# EAGLE schematic Car-layout (EAGLE 6.6.0)
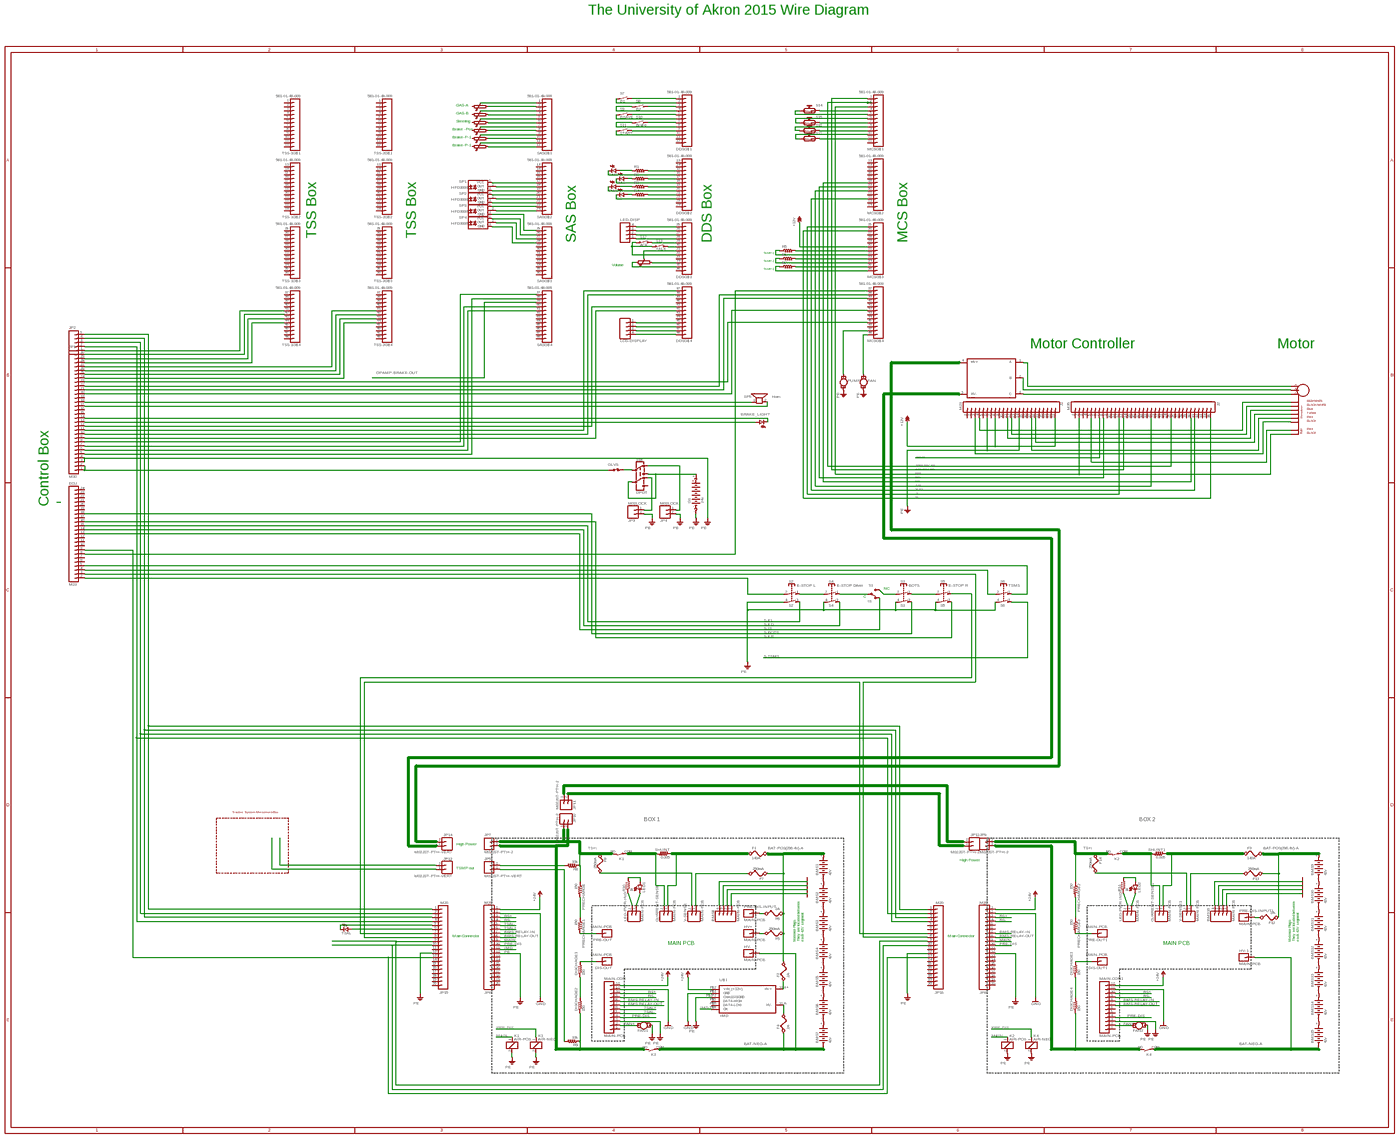
[diagram p0: schematic, sheet 1, overview]
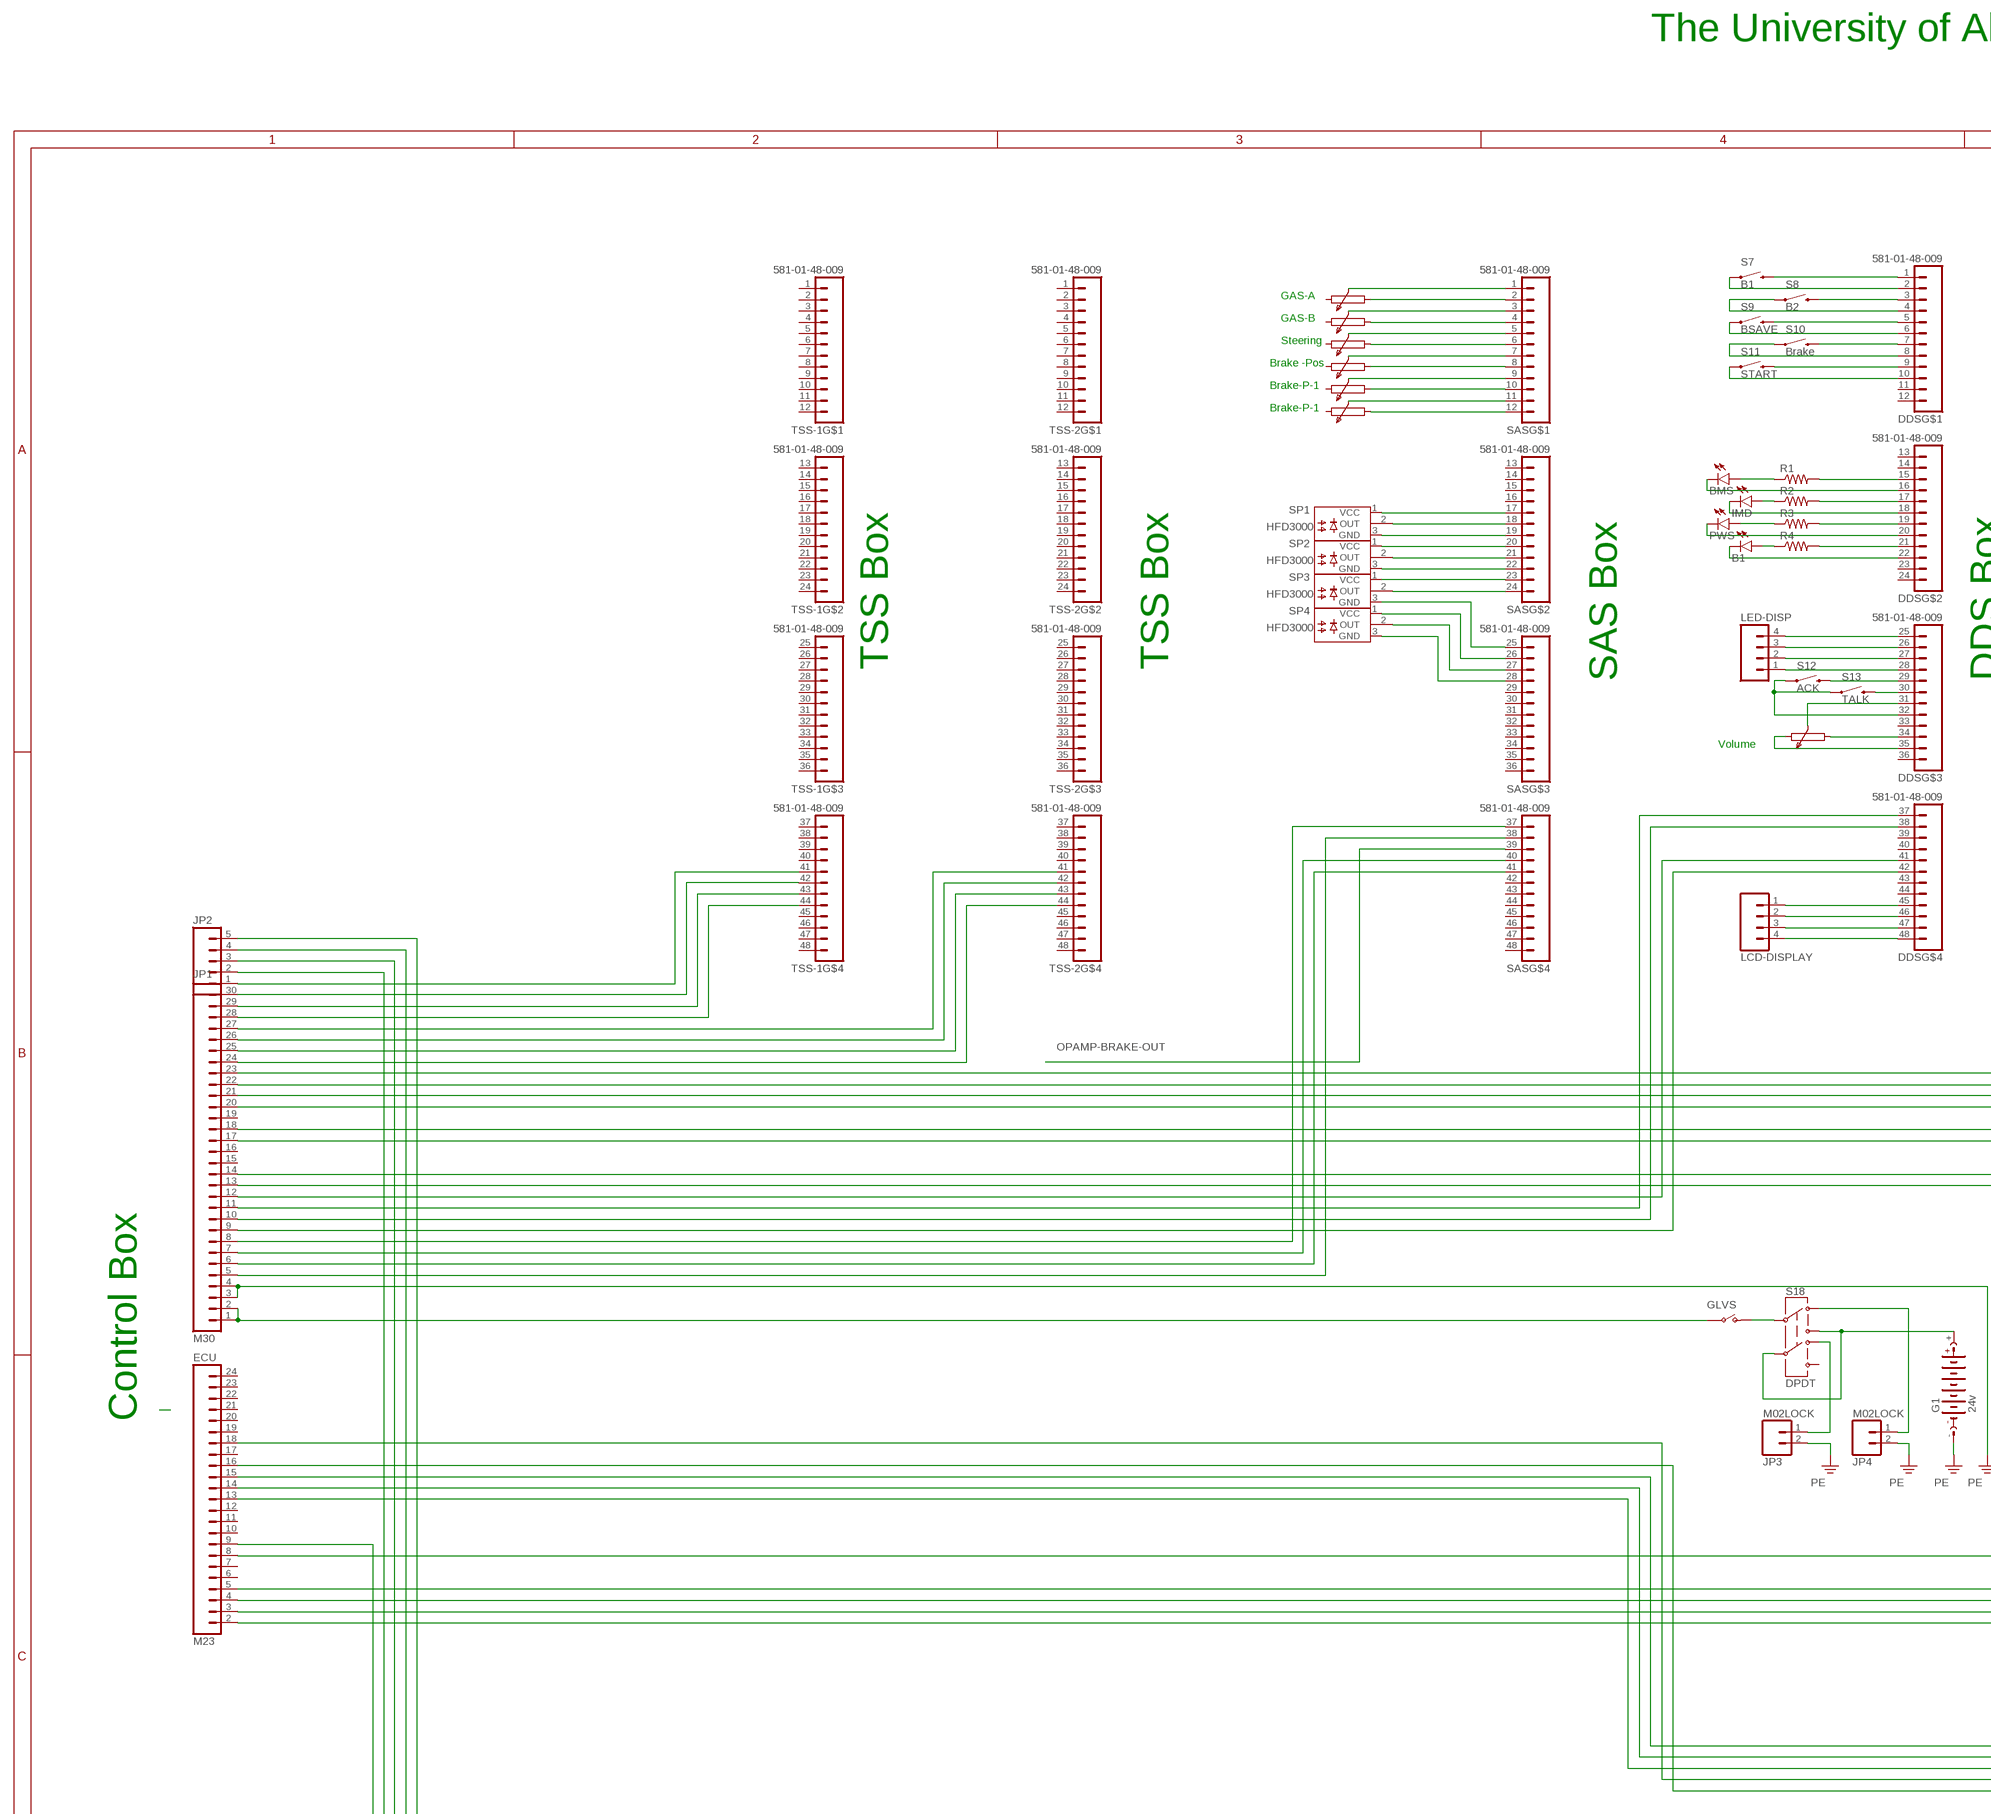
[diagram p1: schematic, sheet 1, part 1 of 4]
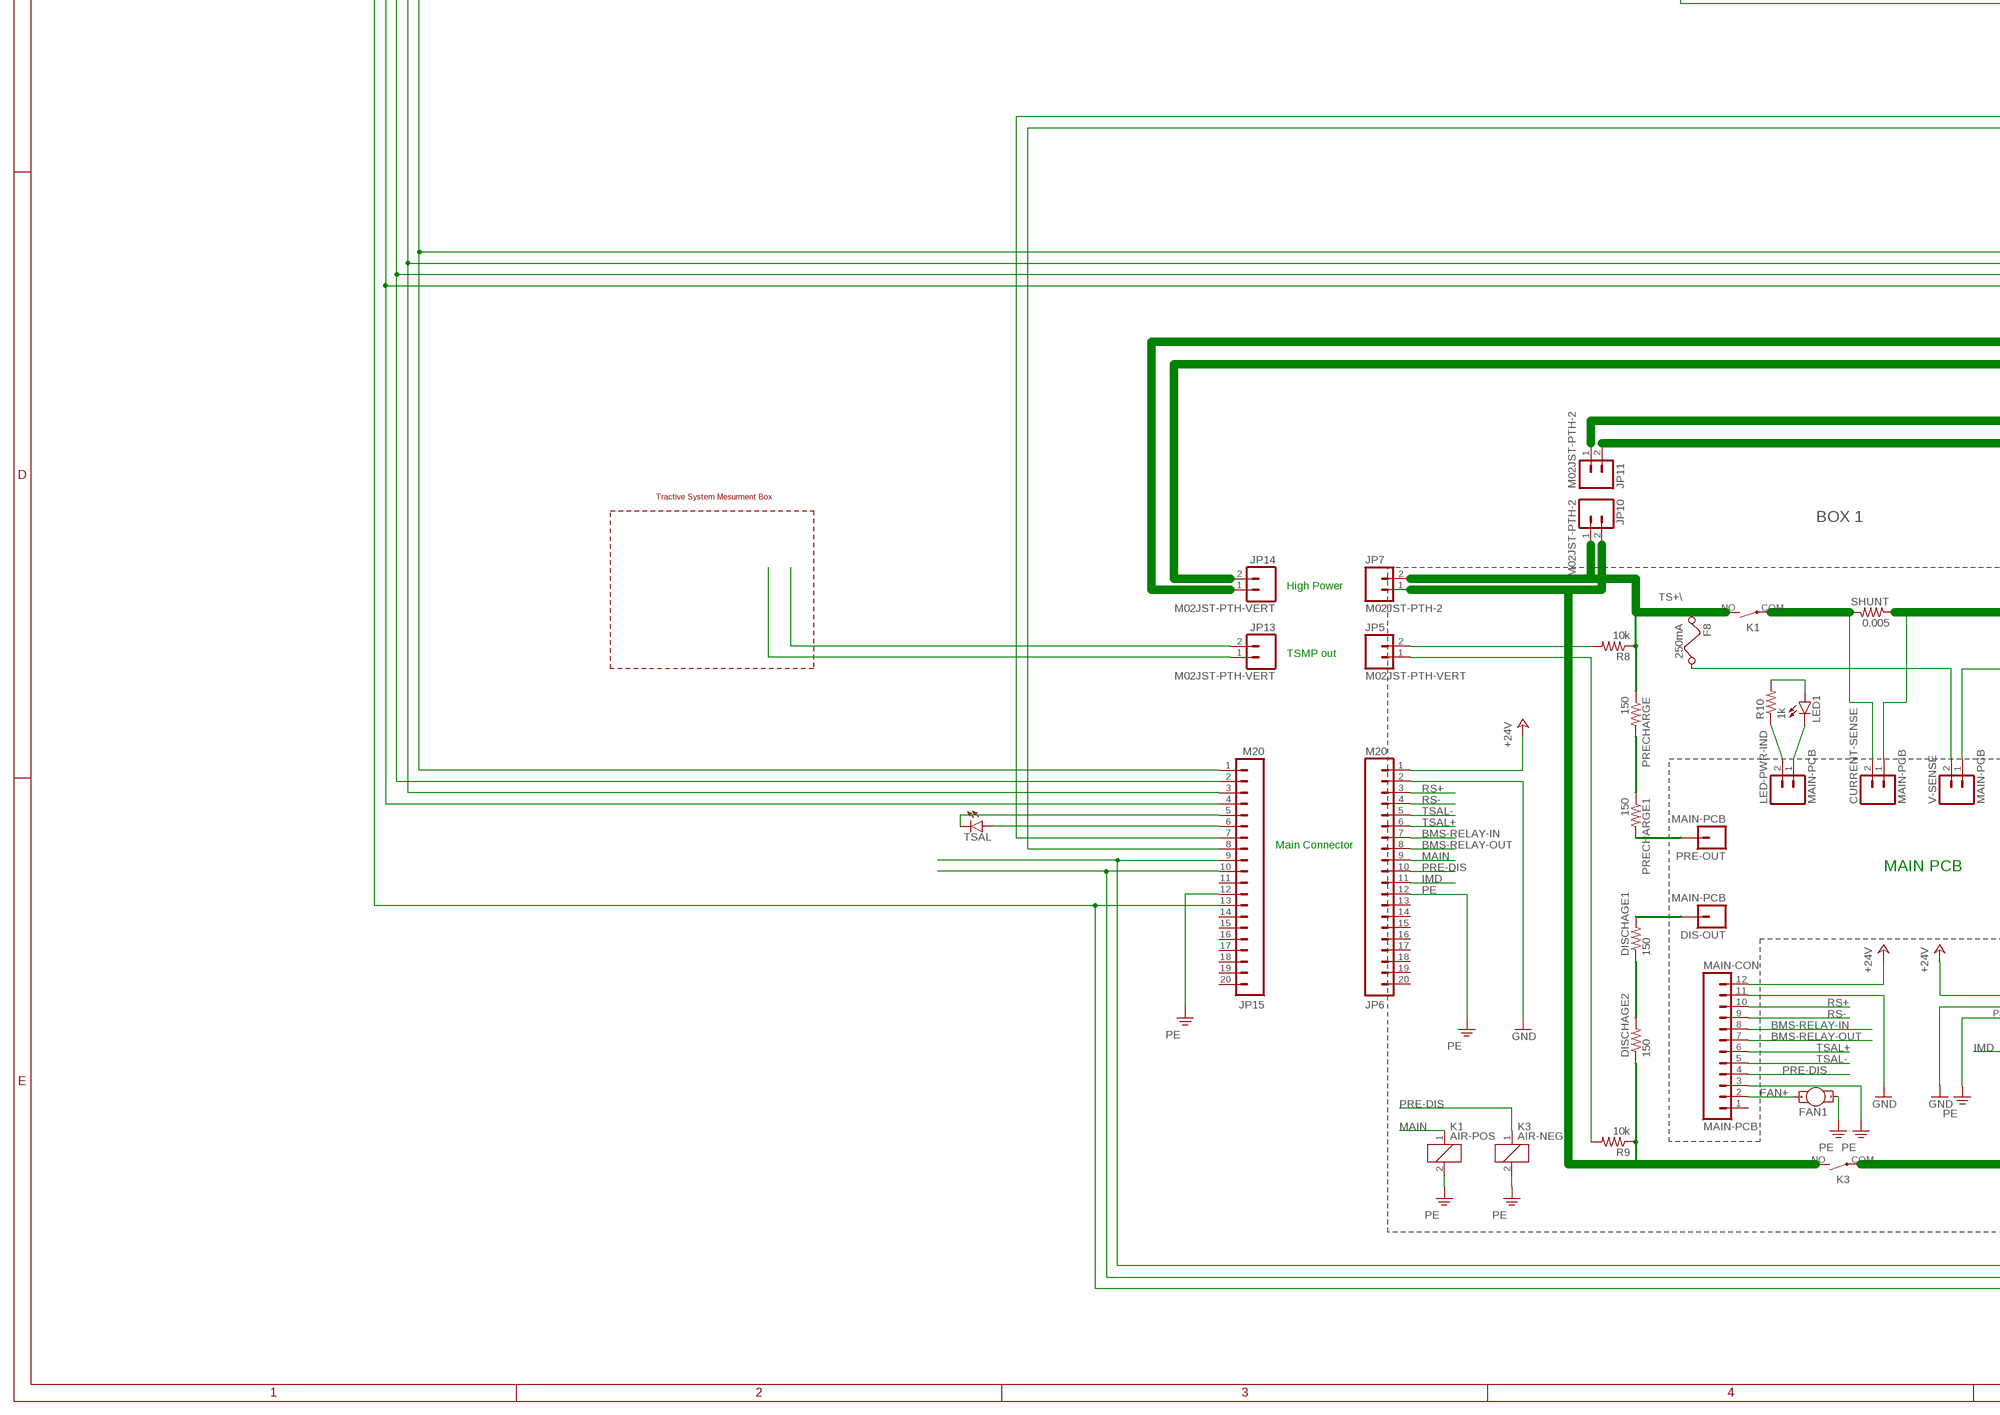
[diagram p2: schematic, sheet 1, part 2 of 4]
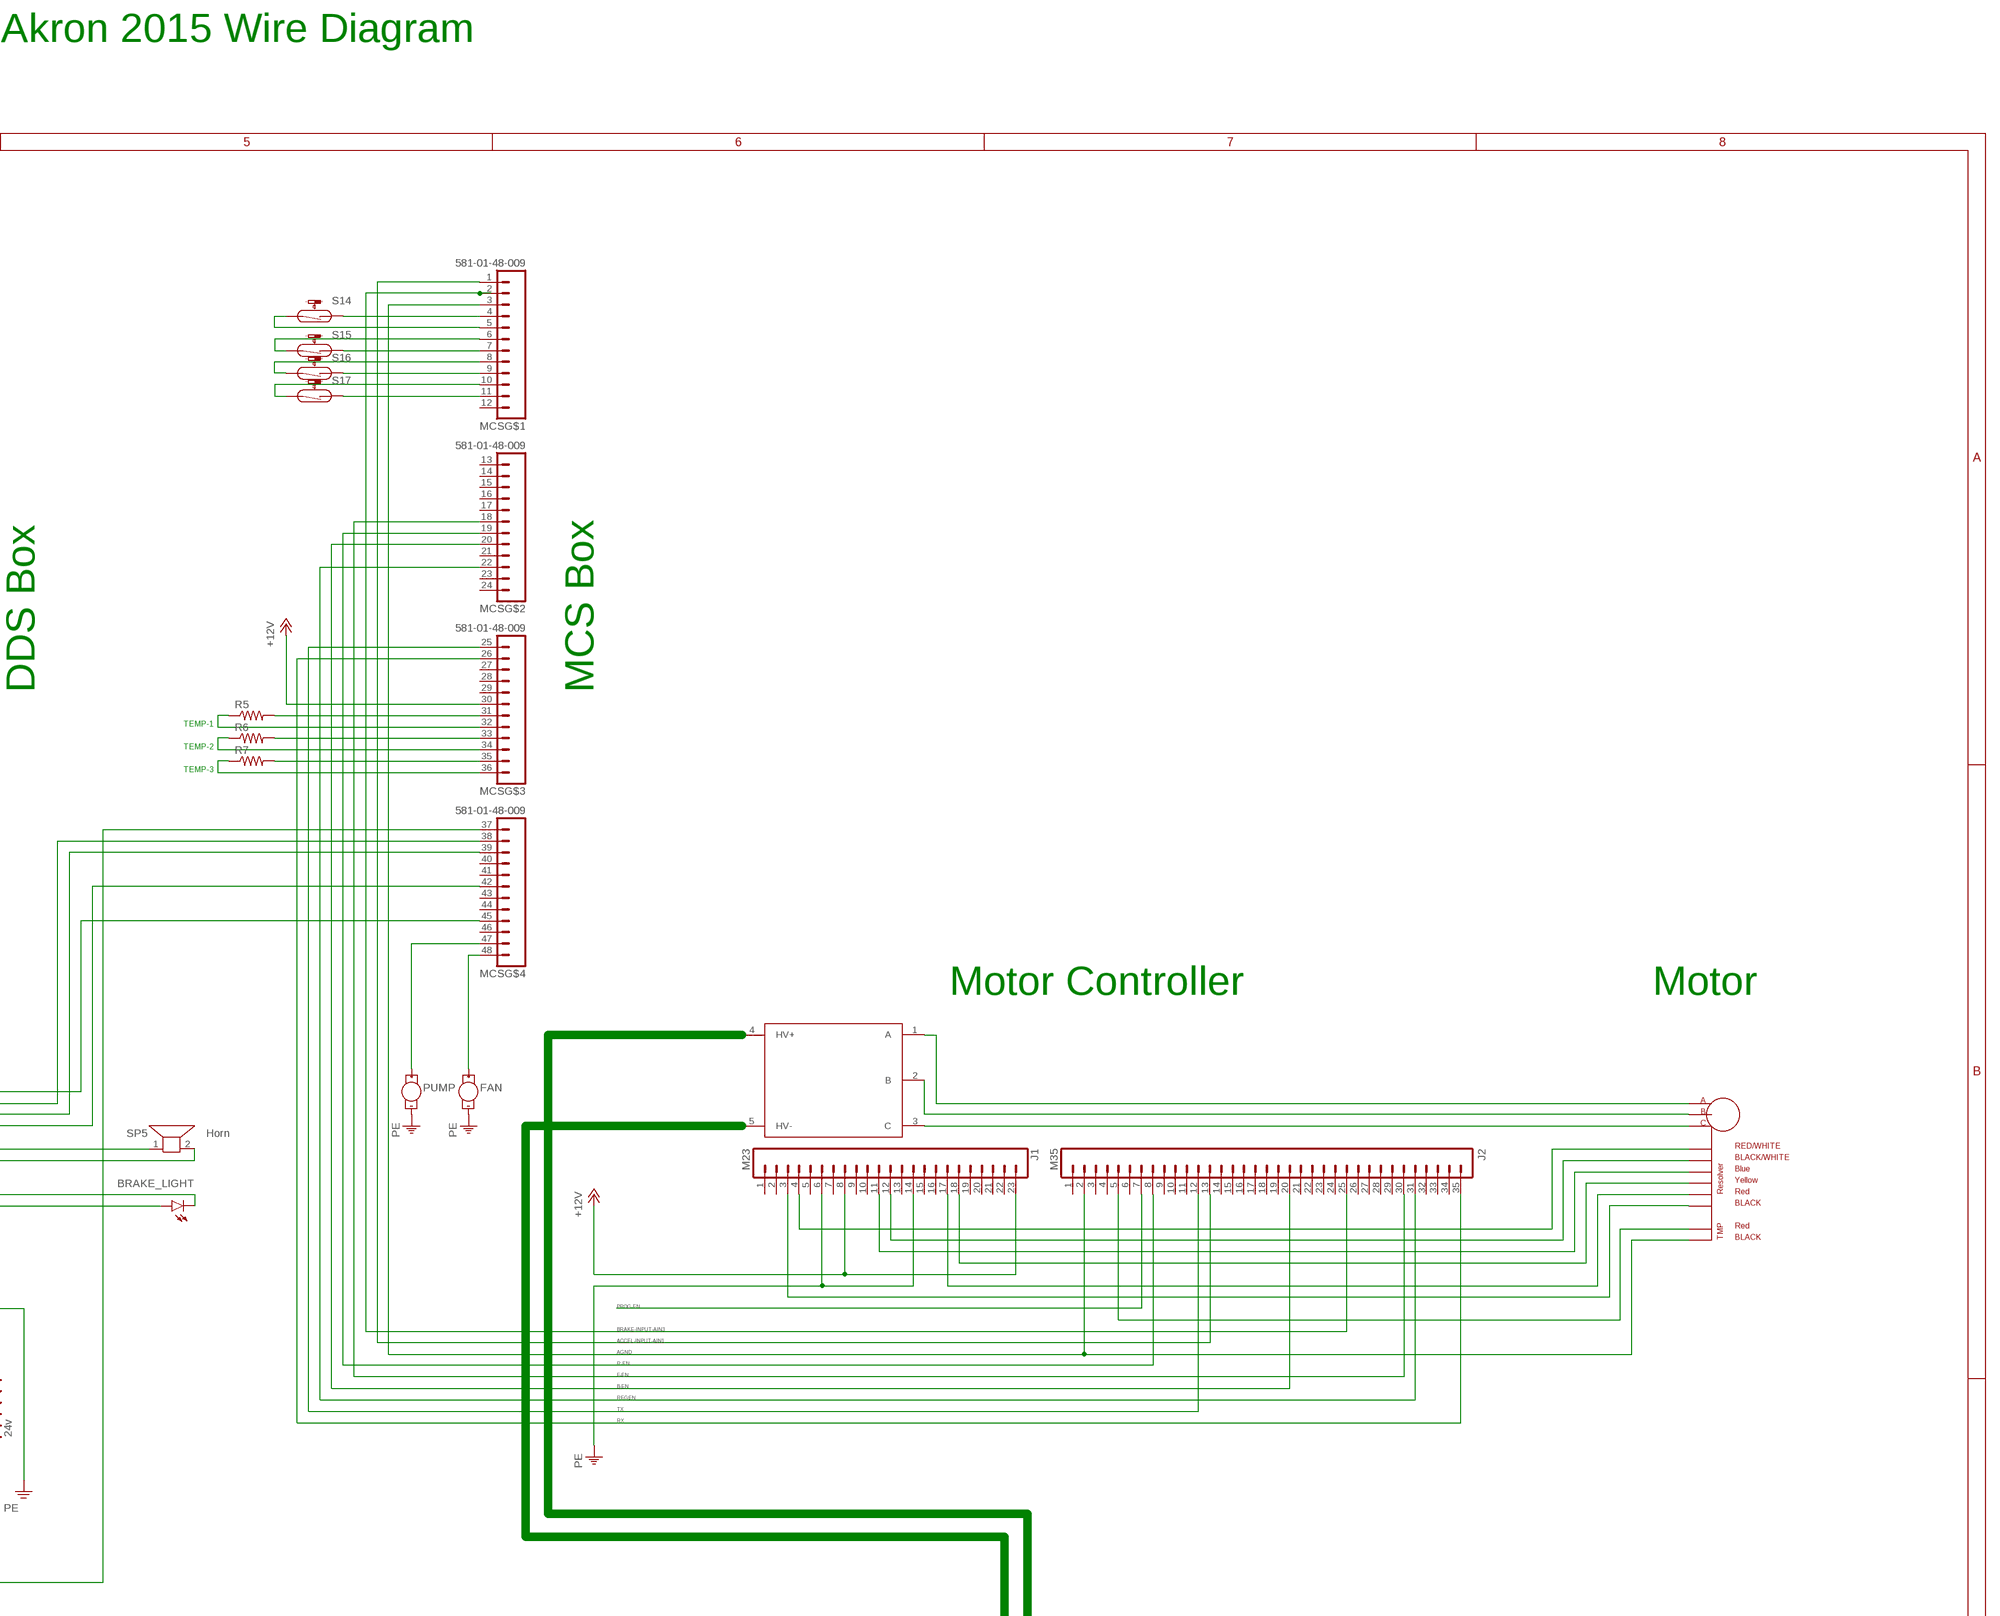
[diagram p3: schematic, sheet 1, part 3 of 4]
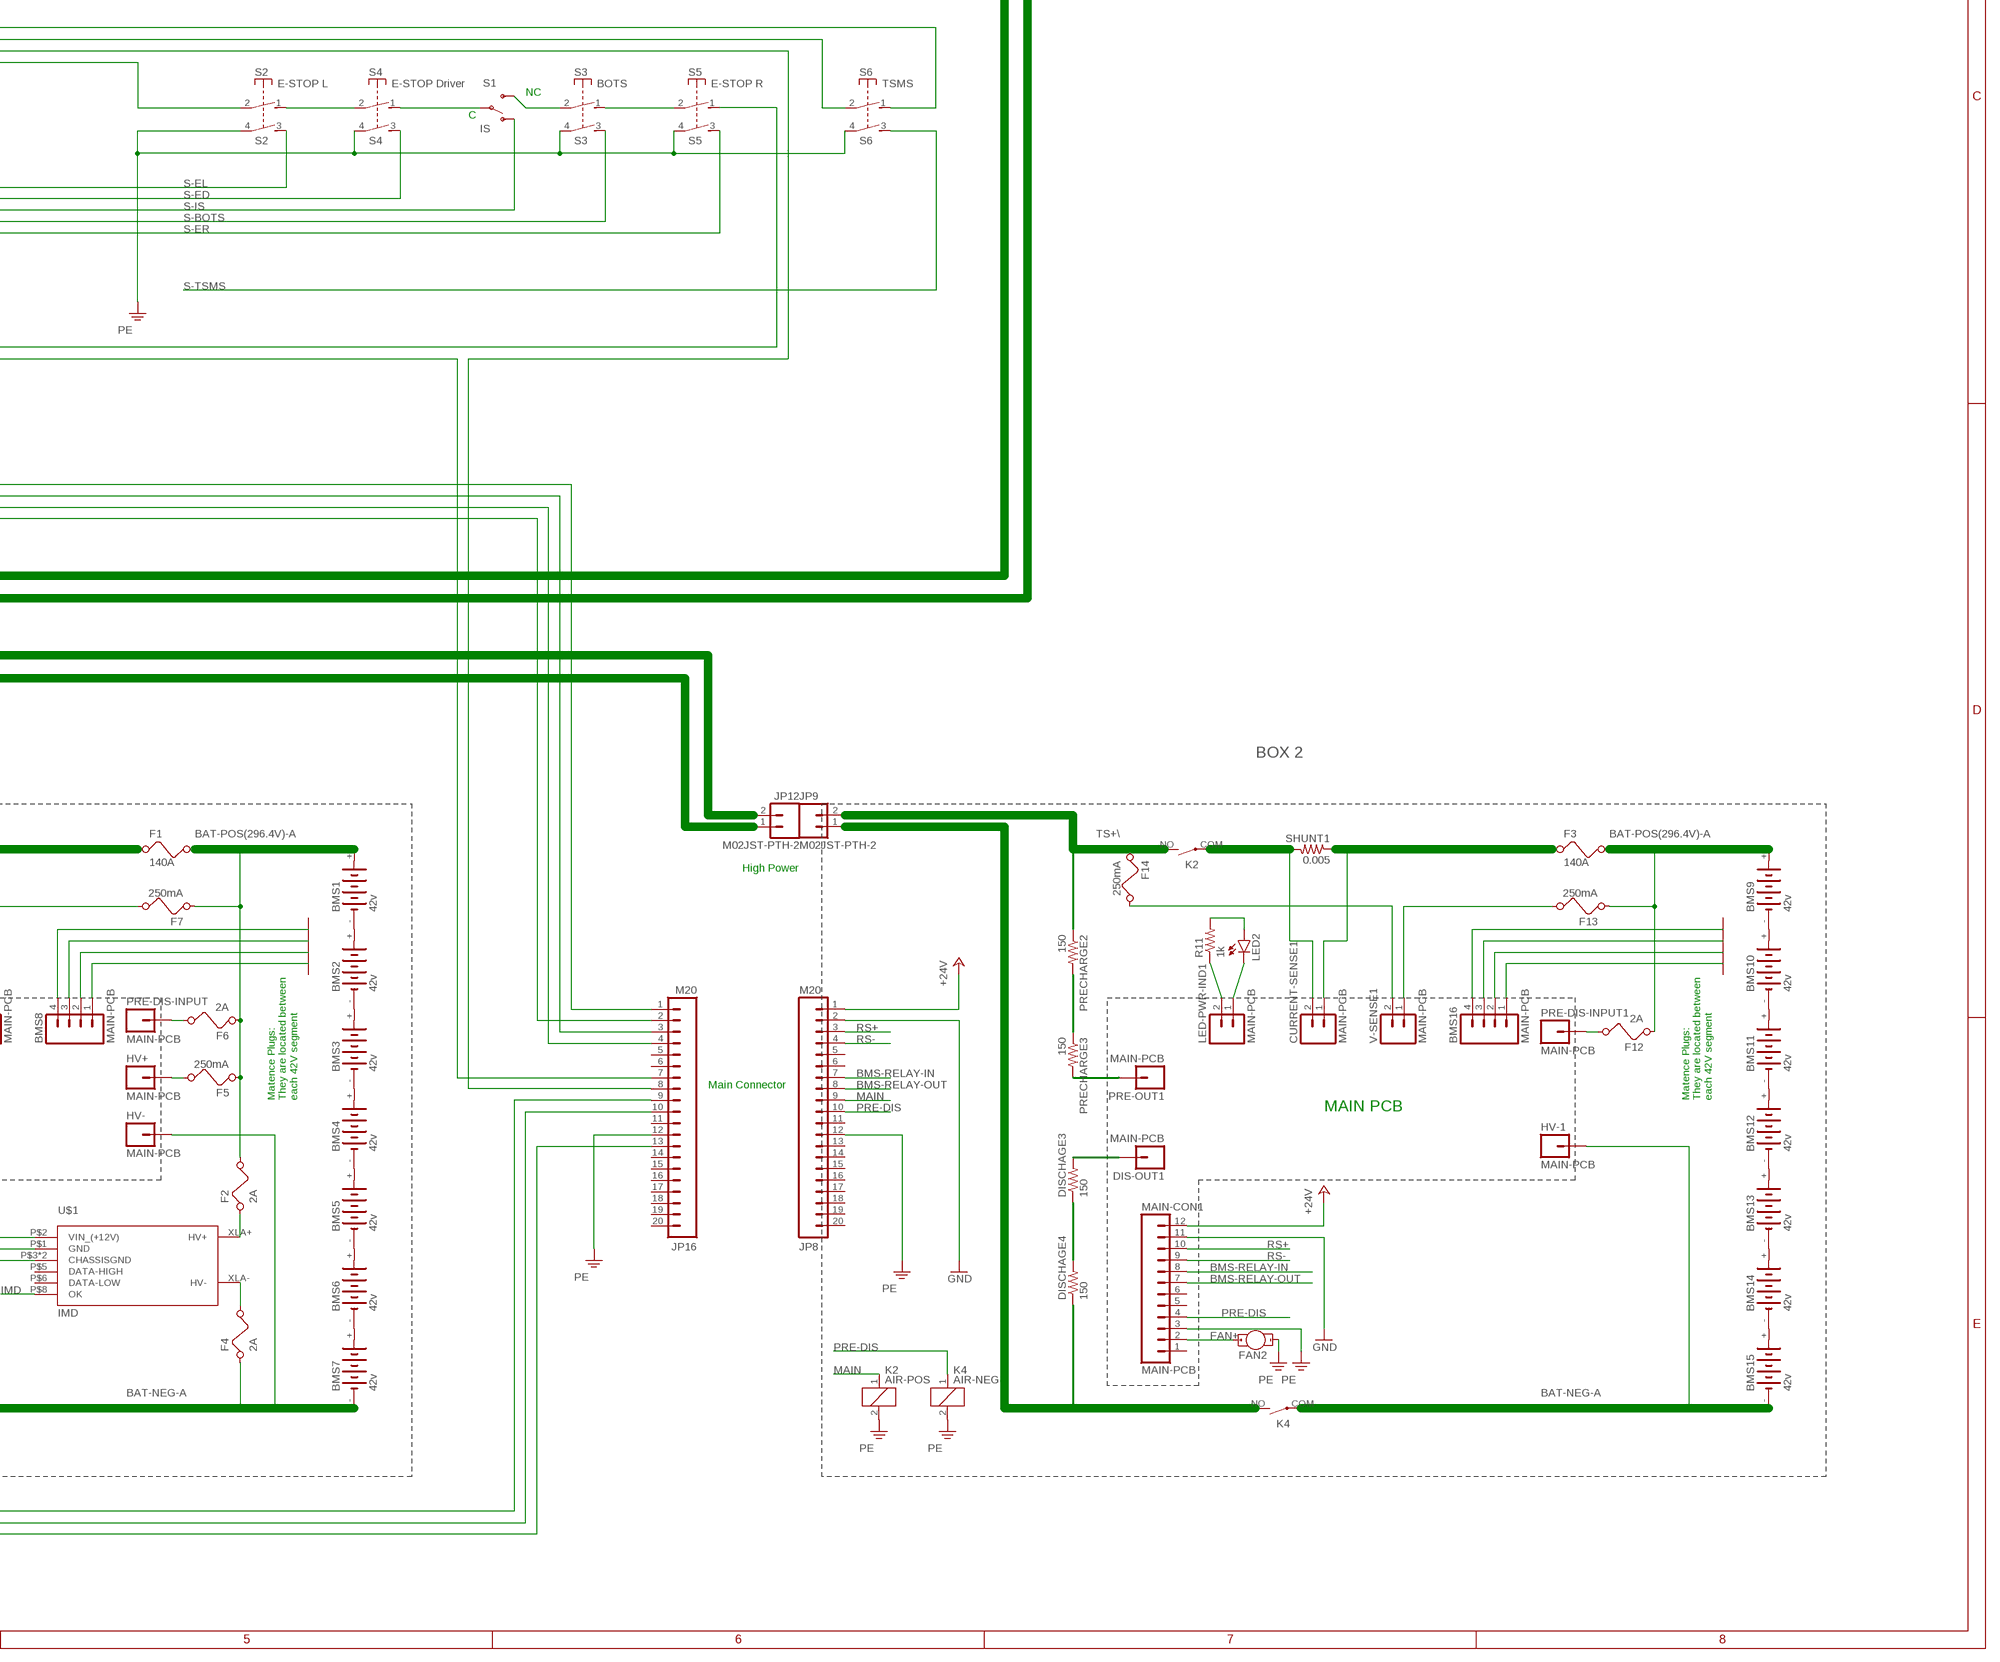
[diagram p4: schematic, sheet 1, part 4 of 4]

## Parts
B1  LED5MM  [LED5MM]
BMS  LED5MM  [LED5MM]
BMS1  42v  VST4V8  [VST4]
BMS2  42v  VST4V8  [VST4]
BMS3  42v  VST4V8  [VST4]
BMS4  42v  VST4V8  [VST4]
BMS5  42v  VST4V8  [VST4]
BMS6  42v  VST4V8  [VST4]
BMS7  42v  VST4V8  [VST4]
BMS8  MAIN-PCB  M04LOCK_LONGPADS  [1X04_LOCK_LONGPADS]
BMS9  42v  VST4V8  [VST4]
BMS10  42v  VST4V8  [VST4]
BMS11  42v  VST4V8  [VST4]
BMS12  42v  VST4V8  [VST4]
BMS13  42v  VST4V8  [VST4]
BMS14  42v  VST4V8  [VST4]
BMS15  42v  VST4V8  [VST4]
BMS16  MAIN-PCB  M04LOCK_LONGPADS  [1X04_LOCK_LONGPADS]
BRAKE_LIGHT  LED5MM  [LED5MM]
CURRENT-SENSE  MAIN-PCB  M02-JST-2-PTH-NO_SILK  [JST-2-PTH-NS]
CURRENT-SENSE1  MAIN-PCB  M02-JST-2-PTH-NO_SILK  [JST-2-PTH-NS]
DDS  581-01-48-009  [581-01-48-009]
DIS-OUT  MAIN-PCB  M01OFFSET  [1X01_OFFSET]
DIS-OUT1  MAIN-PCB  M01OFFSET  [1X01_OFFSET]
DISCHAGE1  150  2.0KOHM1/10W5%(0603)  [0603-RES]
DISCHAGE2  150  2.0KOHM1/10W5%(0603)  [0603-RES]
DISCHAGE3  150  2.0KOHM1/10W5%(0603)  [0603-RES]
DISCHAGE4  150  2.0KOHM1/10W5%(0603)  [0603-RES]
ECU  M23  [1X23]
F1  140A  FUSE  [FUSE]
F2  2A  FUSE  [FUSE]
F3  140A  FUSE  [FUSE]
F4  2A  FUSE  [FUSE]
F5  250mA  FUSE  [FUSE]
F6  2A  FUSE  [FUSE]
F7  250mA  FUSE  [FUSE]
F8  250mA  FUSE  [FUSE]
F12  2A  FUSE  [FUSE]
F13  250mA  FUSE  [FUSE]
F14  250mA  FUSE  [FUSE]
FAN  MOTOR10MM  [VIBE-MOTOR-10MM]
FAN1  MOTOR10MM  [VIBE-MOTOR-10MM]
FAN2  MOTOR10MM  [VIBE-MOTOR-10MM]
G1  24v  AB9V  [AB9V]
GLVS  SWITCH-SPST-2TV  [SWITCH-SPST-VERTICAL]
HV+  MAIN-PCB  M01OFFSET  [1X01_OFFSET]
HV-  MAIN-PCB  M01OFFSET  [1X01_OFFSET]
HV-1  MAIN-PCB  M01OFFSET  [1X01_OFFSET]
IMD  LED5MM  [LED5MM]
J1  M23  [1-770669-1]
J2  M35  [1-776163-2]
JP1  M30  [1X30]
JP2  M05LOCK  [1X05_LOCK]
JP3  M02LOCK  [1X02_LOCK]
JP4  M02LOCK  [1X02_LOCK]
JP5  M02JST-PTH-VERT  [JST-2-PTH-VERT]
JP6  M20  [1X20]
JP7  M02JST-PTH-2  [JST-2-PTH]
JP8  M20  [1X20]
JP9  M02JST-PTH-2  [JST-2-PTH]
JP10  M02JST-PTH-2  [JST-2-PTH]
JP11  M02JST-PTH-2  [JST-2-PTH]
JP12  M02JST-PTH-2  [JST-2-PTH]
JP13  M02JST-PTH-VERT  [JST-2-PTH-VERT]
JP14  M02JST-PTH-VERT  [JST-2-PTH-VERT]
JP15  M20  [1X20]
JP16  M20  [1X20]
K1  AIR-POS  APF30212A  [APF30212A]
K2  AIR-POS  APF30212A  [APF30212A]
K3  AIR-NEG  APF30212A  [APF30212A]
K4  AIR-NEG  APF30212A  [APF30212A]
LCD-DISPLAY  M04LONGPADS  [1X04_LONGPADS]
LED1  LED5MM  [LED5MM]
LED2  LED5MM  [LED5MM]
LED-DISP  M04LONGPADS  [1X04_LONGPADS]
LED-PWR-IND  MAIN-PCB  M02-JST-2-PTH-NO_SILK  [JST-2-PTH-NS]
LED-PWR-IND1  MAIN-PCB  M02-JST-2-PTH-NO_SILK  [JST-2-PTH-NS]
M1  MOTOR-3PHASE  [MC3PHASE]
MAIN-CON  MAIN-PCB  M12LOCK  [1X12_LOCK]
MAIN-CON1  MAIN-PCB  M12LOCK  [1X12_LOCK]
MC-1  PM100DX  [MC-5]
MCS  581-01-48-009  [581-01-48-009]
PRE-DIS-INPUT  MAIN-PCB  M01OFFSET  [1X01_OFFSET]
PRE-DIS-INPUT1  MAIN-PCB  M01OFFSET  [1X01_OFFSET]
PRE-OUT  MAIN-PCB  M01OFFSET  [1X01_OFFSET]
PRE-OUT1  MAIN-PCB  M01OFFSET  [1X01_OFFSET]
PRECHARGE  150  2.0KOHM1/10W5%(0603)  [0603-RES]
PRECHARGE1  150  2.0KOHM1/10W5%(0603)  [0603-RES]
PRECHARGE2  150  2.0KOHM1/10W5%(0603)  [0603-RES]
PRECHARGE3  150  2.0KOHM1/10W5%(0603)  [0603-RES]
PUMP  MOTOR10MM  [VIBE-MOTOR-10MM]
PWS  LED5MM  [LED5MM]
R1  RESISTOR0805-RES  [0805]
R2  RESISTOR0805-RES  [0805]
R3  RESISTOR0805-RES  [0805]
R4  RESISTOR0805-RES  [0805]
R5  RESISTOR0805-RES  [0805]
R6  RESISTOR0805-RES  [0805]
R7  RESISTOR0805-RES  [0805]
R8  10k  RESISTOR0805-RES  [0805]
R9  10k  RESISTOR0805-RES  [0805]
R10  1k  2.0KOHM1/10W5%(0603)  [0603-RES]
R11  1k  2.0KOHM1/10W5%(0603)  [0603-RES]
S1  IS  SWITCH-SPDTPTH2  [SWITCHE-DPDT]
S2  E-STOP L  PVA1  [PVA1F]
S3  BOTS  PVA1  [PVA1F]
S4  E-STOP Driver  PVA1  [PVA1F]
S5  E-STOP R  PVA1  [PVA1F]
S6  TSMS  PVA1  [PVA1F]
S7  B1  SWITCH-MOMENTARY-2PTH  [TACTILE-PTH]
S8  B2  SWITCH-MOMENTARY-2PTH  [TACTILE-PTH]
S9  BSAVE  SWITCH-MOMENTARY-2PTH  [TACTILE-PTH]
S10  Brake  SWITCH-MOMENTARY-2PTH  [TACTILE-PTH]
S11  START  SWITCH-MOMENTARY-2PTH  [TACTILE-PTH]
S12  ACK  SWITCH-MOMENTARY-2PTH  [TACTILE-PTH]
S13  TALK  SWITCH-MOMENTARY-2PTH  [TACTILE-PTH]
S14  REED-SWITCH-CT10-1530-G1  [CT10-G1]
S15  REED-SWITCH-CT10-1530-G1  [CT10-G1]
S16  REED-SWITCH-CT10-1530-G1  [CT10-G1]
S17  REED-SWITCH-CT10-1530-G1  [CT10-G1]
S18  DPDT  SWITCH-DPDTAYZ0202  [AYZ0202]
SAS  581-01-48-009  [581-01-48-009]
SHUNT  0.005  2.0KOHM1/10W5%(0603)  [0603-RES]
SHUNT1  0.005  2.0KOHM1/10W5%(0603)  [0603-RES]
SP1  HFD3000  [TO46-FW3]
SP2  HFD3000  [TO46-FW3]
SP3  HFD3000  [TO46-FW3]
SP4  HFD3000  [TO46-FW3]
SP5  Horn  AL23P  [AL23P]
TSAL  LED5MM  [LED5MM]
TSS-1  581-01-48-009  [581-01-48-009]
TSS-2  581-01-48-009  [581-01-48-009]
U$1  IMD  [IMD]
V-SENSE  MAIN-PCB  M02-JST-2-PTH-NO_SILK  [JST-2-PTH-NS]
V-SENSE1  MAIN-PCB  M02-JST-2-PTH-NO_SILK  [JST-2-PTH-NS]

## Nets
+12V: J1.8 J1.23 MCS.30
+24V: JP6.1 JP8.1 MAIN-CON1.12 MAIN-CON.12 U$1.P$2(VIN_(+12V))
ACCEL-INPUT-AIN1: J2.13 MCS.1
AGND: J2.2 M1.9 MCS.3
B-EN: J2.20 MCS.20
BAT-NEG-A: BMS7.- BMS15.- F4.1 HV-1.1 HV-.1 K3.COM(2:P) K4.COM(2:P)
BAT-POS(296.4V)-A: BMS1.+ BMS9.+ F1.2 F2.2 F3.2 F5.1 F6.1 F7.1 F12.1 F13.1
BMS-RELAY-IN: JP6.7 JP8.7 MAIN-CON1.8 MAIN-CON.8
BMS-RELAY-OUT: JP6.8 JP8.8 MAIN-CON1.7 MAIN-CON.7
BRAKE-INPUT-AIN3: J2.25 MCS.2
F-EN: J2.30 MCS.18
FAN+: FAN1.+ FAN2.+ MAIN-CON1.2 MAIN-CON.2
GND: JP6.2 JP8.2 MAIN-CON1.11 MAIN-CON.11 U$1.P$1(GND)
IMD: JP6.11 U$1.P$8(OK)
MAIN: JP6.9 JP8.9 K1.1 K2.1
MP1: BMS1.- BMS2.+
MP2: BMS9.- BMS10.+
N$1: ECU.2 S2.2(1:P)
N$2: S2.1(1:S) S4.2(1:P)
N$3: S1.2(P) S4.1(1:S)
N$4: S1.3(S) S3.2(1:P)
N$5: S3.1(1:S) S5.2(1:P)
N$6: ECU.3 JP16.8
N$7: ECU.4 S6.2(1:P)
N$8: ECU.5 S6.1(1:S)
N$9: ECU.8 MCS.37
N$10: SAS.1
N$11: SAS.2
N$12: SAS.3
N$13: SAS.4
N$14: SAS.5
N$15: SAS.6
N$16: SAS.7
N$17: SAS.8
N$18: SAS.9
N$19: SAS.10
N$20: SAS.11
N$21: SAS.12
N$22: SAS.23 SP3.1(VCC)
N$23: SAS.24 SP3.2(OUT)
N$24: SAS.25 SP3.3(GND)
N$25: SAS.17 SP1.1(VCC)
N$26: SAS.19 SP1.3(GND)
N$27: SAS.18 SP1.2(OUT)
N$28: SAS.20 SP2.1(VCC)
N$29: SAS.22 SP2.3(GND)
N$30: SAS.21 SP2.2(OUT)
N$31: SAS.26 SP4.1(VCC)
N$32: SAS.27 SP4.2(OUT)
N$33: SAS.28 SP4.3(GND)
N$34: JP1.8 SAS.37
N$35: JP1.5 SAS.38
N$36: JP1.7 SAS.40
N$37: JP1.6 SAS.41
N$38: DDS.1 S7.3
N$39: DDS.2 S7.1
N$40: DDS.3 S8.3
N$41: DDS.4 S8.1
N$42: DDS.5 S9.3
N$43: DDS.6 S9.1
N$44: DDS.7 S10.3
N$45: DDS.8 S10.1
N$46: DDS.9 S11.3
N$47: DDS.10 S11.1
N$48: IMD.A R2.1
N$49: DDS.17 R2.2
N$50: DDS.18 IMD.K(C)
N$51: BMS.A R1.1
N$52: DDS.15 R1.2
N$53: BMS.K(C) DDS.16
N$54: PWS.A R3.1
N$55: DDS.19 R3.2
N$56: DDS.20 PWS.K(C)
N$57: B1.A R4.1
N$58: DDS.21 R4.2
N$59: B1.K(C) DDS.22
N$60: DDS.28 LED-DISP.1
N$61: DDS.27 LED-DISP.2
N$62: DDS.26 LED-DISP.3
N$63: DDS.25 LED-DISP.4
N$64: DDS.32 S12.1 S13.1
N$65: DDS.29 S12.3
N$66: DDS.30 S13.3
N$67: DDS.41 JP1.12
N$68: DDS.34
N$69: DDS.31
N$70: DDS.35
N$71: DDS.42 JP1.9
N$72: DDS.37 JP1.11
N$73: DDS.38 JP1.10
N$74: DDS.48 LCD-DISPLAY.4
N$75: DDS.47 LCD-DISPLAY.3
N$76: DDS.46 LCD-DISPLAY.2
N$77: DDS.45 LCD-DISPLAY.1
N$78: GLVS.2(P) JP1.1 JP1.2
N$79: GLVS.1(O) S18.2
N$80: M1.1(A) MC-1.1(A)
N$81: M1.3(C) MC-1.3(C)
N$82: M1.2(B) MC-1.2(B)
N$83: J2.5 M1.8
N$84: JP1.23 MCS.45
N$85: J1.17 M1.10
N$86: J1.3 M1.11
N$87: J1.18 M1.7
N$88: J1.11 M1.6
N$89: J1.12 M1.5
N$90: J1.4 M1.4
N$91: JP1.20 MCS.42
N$92: JP1.22 MCS.38
N$93: JP1.21 MCS.39
N$94: FAN.+ MCS.48
N$95: MCS.47 PUMP.+
N$96: MCS.31 R5.2
N$97: MCS.32 R5.1
N$98: MCS.34 R6.1
N$99: MCS.33 R6.2
N$100: MCS.36 R7.1
N$101: MCS.35 R7.2
N$102: MCS.4 S14.1
N$103: MCS.5 S14.2
N$104: MCS.7 S15.1
N$105: MCS.6 S15.2
N$106: MCS.9 S16.1
N$107: MCS.8 S16.2
N$108: MCS.11 S17.1
N$109: MCS.10 S17.2
N$110: JP4.1 S18.1
N$111: G1.+ S18.3 S18.5
N$112: BRAKE_LIGHT.A JP1.13
N$113: BRAKE_LIGHT.K(C) JP1.14
N$114: JP3.1 S18.4
N$115: JP1.18 SP5.1
N$116: JP1.17 SP5.2
N$117: JP2.1 TSS-1.41
N$118: JP1.28 TSS-1.44
N$119: JP1.30 TSS-1.42
N$120: JP1.29 TSS-1.43
N$121: JP1.24 TSS-2.44
N$122: JP1.25 TSS-2.43
N$123: JP1.26 TSS-2.42
N$124: JP1.27 TSS-2.41
N$125: BMS2.- BMS3.+
N$126: BMS3.- BMS4.+
N$127: BMS4.- BMS5.+
N$128: BMS5.- BMS6.+
N$129: BMS6.- BMS7.+
N$130: JP5.2 R8.2
N$131: JP5.1 R9.2
N$132: F4.2 U$1.XLA-(HV-)
N$133: F2.1 U$1.XLA+(HV+)
N$134: CURRENT-SENSE.2 K1.COM(2:P) SHUNT.2
N$135: CURRENT-SENSE.1 F1.1 SHUNT.1
N$136: F5.2 HV+.1
N$137: LED-PWR-IND.2 R10.1
N$138: LED1.A R10.2
N$139: LED1.K(C) LED-PWR-IND.1
N$140: F6.2 PRE-DIS-INPUT.1
N$141: F7.2 V-SENSE.1
N$142: F8.2 V-SENSE.2
N$143: BMS8.1
N$144: BMS8.2
N$145: BMS8.3
N$146: BMS8.4
N$147: DISCHAGE2.1 JP7.1 K3.NO(2:S) R9.1
N$148: PRECHARGE1.1 PRECHARGE.2
N$149: PRE-OUT.1 PRECHARGE1.2
N$150: DIS-OUT.1 DISCHAGE1.2
N$151: DISCHAGE1.1 DISCHAGE2.2
N$152: BMS10.- BMS11.+
N$153: BMS11.- BMS12.+
N$154: BMS12.- BMS13.+
N$155: BMS13.- BMS14.+
N$156: BMS14.- BMS15.+
N$157: CURRENT-SENSE1.2 K2.COM(2:P) SHUNT1.2
N$158: CURRENT-SENSE1.1 F3.1 SHUNT1.1
N$159: LED-PWR-IND1.2 R11.1
N$160: LED2.A R11.2
N$161: LED2.K(C) LED-PWR-IND1.1
N$162: F12.2 PRE-DIS-INPUT1.1
N$163: F13.2 V-SENSE1.1
N$164: F14.2 V-SENSE1.2
N$165: BMS16.1
N$166: BMS16.2
N$167: BMS16.3
N$168: BMS16.4
N$169: DISCHAGE4.1 JP9.1 K4.NO(2:S)
N$170: PRECHARGE2.2 PRECHARGE3.1
N$171: PRE-OUT1.1 PRECHARGE3.2
N$172: DIS-OUT1.1 DISCHAGE3.2
N$173: DISCHAGE3.1 DISCHAGE4.2
N$174: JP15.6 TSAL.A
N$175: JP13.2
N$176: JP13.1
N$177: JP14.2 MC-1.4(HV+)
N$178: JP14.1 MC-1.5(HV-)
N$179: JP15.5 TSAL.K(C)
N$180: JP2.4 JP15.3 JP16.3
N$181: JP2.3 JP15.2 JP16.4
N$182: JP2.5 JP15.1 JP16.1
N$183: JP2.2 JP15.4 JP16.2
N$184: JP15.7 S5.1(1:S)
N$185: JP15.8 JP16.7
N$187: JP15.10 JP16.10
N$188: ECU.9 JP15.13 JP16.13
N$189: JP15.9 JP16.9
OPAMP-BRAKE-OUT: SAS.39
PE: FAN1.- FAN2.- FAN.- G1.- J1.6 J1.14 JP1.3 JP1.4 JP3.2 JP4.2 JP6.12 JP8.12 JP15.12 JP16.12 K1.2 K2.2 K3.2 K4.2 MAIN-CON1.3 MAIN-CON.3 PUMP.- S2.4(2:P) S3.4(2:P) S4.4(2:P) S5.4(2:P) S6.4(2:P) U$1.P$3(CHASSISGND) U$1.P$4(CHASSISGND)
PRE-DIS: JP6.10 JP8.10 K3.1 K4.1 MAIN-CON1.4 MAIN-CON.4
PROG-EN: J2.7
R-EN: J2.8 MCS.19
REGEN: J2.31 MCS.22
RS+: JP6.3 JP8.3 MAIN-CON1.10 MAIN-CON.10
RS-: JP6.4 JP8.4 MAIN-CON1.9 MAIN-CON.9
RX: J2.35 MCS.26
S-BOTS: ECU.18 S3.3(2:S)
S-ED: ECU.14 S4.3(2:S)
S-EL: ECU.15 S2.3(2:S)
S-ER: ECU.16 S5.3(2:S)
S-IS: ECU.13 S1.1(O)
S-TSMS: S6.3(2:S)
TS+\: F8.1 F14.1 JP7.2 JP9.2 JP10.1 JP10.2 JP11.1 JP11.2 JP12.1 JP12.2 K1.NO(2:S) K2.NO(2:S) PRECHARGE2.1 PRECHARGE.1 R8.1
TSAL+: JP6.6 MAIN-CON.6
TSAL-: JP6.5 MAIN-CON.5
TX: J2.12 MCS.25
Unconnected: BMS1.+@1(+) BMS2.+@1(+) BMS3.+@1(+) BMS4.+@1(+) BMS5.+@1(+) BMS6.+@1(+) BMS7.+@1(+) BMS9.+@1(+) BMS10.+@1(+) BMS11.+@1(+) BMS12.+@1(+) BMS13.+@1(+) BMS14.+@1(+) BMS15.+@1(+) DDS.11 DDS.12 DDS.13 DDS.14 DDS.23 DDS.24 DDS.33 DDS.36 DDS.39 DDS.40 DDS.43 DDS.44 ECU.6 ECU.7 ECU.10 ECU.11 ECU.12 ECU.17 ECU.19 ECU.20 ECU.21 ECU.22 ECU.23 ECU.24 J1.1 J1.2 J1.5 J1.7 J1.9 J1.10 J1.13 J1.15 J1.16 J1.19 J1.20 J1.21 J1.22 J2.1 J2.3 J2.4 J2.6 J2.9 J2.10 J2.11 J2.14 J2.15 J2.16 J2.17 J2.18 J2.19 J2.21 J2.22 J2.23 J2.24 J2.26 J2.27 J2.28 J2.29 J2.32 J2.33 J2.34 JP1.15 JP1.16 JP1.19 JP6.13 JP6.14 JP6.15 JP6.16 JP6.17 JP6.18 JP6.19 JP6.20 JP8.5 JP8.6 JP8.11 JP8.13 JP8.14 JP8.15 JP8.16 JP8.17 JP8.18 JP8.19 JP8.20 JP15.11 JP15.14 JP15.15 JP15.16 JP15.17 JP15.18 JP15.19 JP15.20 JP16.5 JP16.6 JP16.11 JP16.14 JP16.15 JP16.16 JP16.17 JP16.18 JP16.19 JP16.20 MAIN-CON1.1 MAIN-CON1.5 MAIN-CON1.6 MAIN-CON.1 MCS.12 MCS.13 MCS.14 MCS.15 MCS.16 MCS.17 MCS.21 MCS.23 MCS.24 MCS.27 MCS.28 MCS.29 MCS.40 MCS.41 MCS.43 MCS.44 MCS.46 S18.6 SAS.13 SAS.14 SAS.15 SAS.16 SAS.29 SAS.30 SAS.31 SAS.32 SAS.33 SAS.34 SAS.35 SAS.36 SAS.42 SAS.43 SAS.44 SAS.45 SAS.46 SAS.47 SAS.48 TSS-1.1 TSS-1.2 TSS-1.3 TSS-1.4 TSS-1.5 TSS-1.6 TSS-1.7 TSS-1.8 TSS-1.9 TSS-1.10 TSS-1.11 TSS-1.12 TSS-1.13 TSS-1.14 TSS-1.15 TSS-1.16 TSS-1.17 TSS-1.18 TSS-1.19 TSS-1.20 TSS-1.21 TSS-1.22 TSS-1.23 TSS-1.24 TSS-1.25 TSS-1.26 TSS-1.27 TSS-1.28 TSS-1.29 TSS-1.30 TSS-1.31 TSS-1.32 TSS-1.33 TSS-1.34 TSS-1.35 TSS-1.36 TSS-1.37 TSS-1.38 TSS-1.39 TSS-1.40 TSS-1.45 TSS-1.46 TSS-1.47 TSS-1.48 TSS-2.1 TSS-2.2 TSS-2.3 TSS-2.4 TSS-2.5 TSS-2.6 TSS-2.7 TSS-2.8 TSS-2.9 TSS-2.10 TSS-2.11 TSS-2.12 TSS-2.13 TSS-2.14 TSS-2.15 TSS-2.16 TSS-2.17 TSS-2.18 TSS-2.19 TSS-2.20 TSS-2.21 TSS-2.22 TSS-2.23 TSS-2.24 TSS-2.25 TSS-2.26 TSS-2.27 TSS-2.28 TSS-2.29 TSS-2.30 TSS-2.31 TSS-2.32 TSS-2.33 TSS-2.34 TSS-2.35 TSS-2.36 TSS-2.37 TSS-2.38 TSS-2.39 TSS-2.40 TSS-2.45 TSS-2.46 TSS-2.47 TSS-2.48 U$1.P$5(DATA-HIGH) U$1.P$6(DATA-LOW)

## Notes on the sheet
- The University of Akron 2015 Wire Diagram
- GAS-A
- GAS-B
- Steering
- Brake -Pos
- Brake-P-1
- Brake-P-1
- TSS Box | TSS Box | SAS Box | DDS Box | MCS Box
- TEMP-1
- TEMP-2
- Volume
- TEMP-3
- Motor Controller | Motor
- Control Box
- NC
- C
- Tractive System Mesurment Box
- BOX 1 | BOX 2
- High Power
- High Power
- TSMP out
- Main Connector | Main Connector
- Matence Plugs:
  They are located between
  each 42V segment
- Matence Plugs:
  They are located between
  each 42V segment
- MAIN PCB | MAIN PCB

## Library data of the parts
B1 BMS BRAKE_LIGHT IMD LED1 LED2 PWS TSAL = SparkFun-LED:LED: LEDs Standard schematic elements and footprints for 5mm, 3mm, 1206, and 0603 sized LEDs. 5mm - Spark Fun Electronics SKU : COM-00529 (and others)
BMS1-BMS7 BMS9-BMS15 = battery:VST4V8: NC ACCU Varta Safe Tronic 4V8
BMS8 BMS16 LCD-DISPLAY LED-DISP = SparkFun-Connectors:M04: Header 4 Standard 4-pin 0.1" header. Use with straight break away headers (SKU : PRT-00116), right angle break away headers (PRT-00553), swiss pins (PRT-00743), machine pins (PRT-00117), and female headers (PRT-00115). Molex polarized connector foot print use with SKU : PRT-08231 with associated crimp pins and housings. 1MM SMD Version SKU: PRT-10208
CURRENT-SENSE CURRENT-SENSE1 JP3-JP5 JP13 JP14 LED-PWR-IND LED-PWR-IND1 V-SENSE V-SENSE1 = SparkFun-Connectors:M02: Standard 2-pin 0.1" header. Use with - straight break away headers ( PRT-00116) - right angle break away headers (PRT-00553) - swiss pins (PRT-00743) - machine pins (PRT-00117) - female headers (PRT-00115) Molex polarized connector foot print use with: PRT-08233 with associated crimp pins and housings. 2.54_SCREWTERM for use with PRT-10571. 3.5mm Screw Terminal footprints for PRT-08084 5mm Screw Terminal footprints for use with PRT-08432
DDS MCS SAS TSS-1 TSS-2 = FSAE Eletric:581-01-48-009
DIS-OUT DIS-OUT1 HV+ HV- HV-1 PRE-DIS-INPUT PRE-DIS-INPUT1 PRE-OUT PRE-OUT1 = SparkFun-Connectors:M01: Header 1 Standard 1-pin 0.1" header. Use with straight break away headers (SKU : PRT-00116), right angle break away headers (PRT-00553), swiss pins (PRT-00743), machine pins (PRT-00117), and female headers (PRT-00115).
DISCHAGE1-DISCHAGE4 PRECHARGE PRECHARGE1-PRECHARGE3 R10 R11 SHUNT SHUNT1 = SparkFun-Resistors:2.0KOHM1/10W5%(0603): RES-08296; PROD_ID: RES-08296; VALUE: 2.0k
ECU = SparkFun-Connectors:M23
F1-F8 F12-F14 = special:FUSE: FUSE 5 x 20 mm
FAN FAN1 FAN2 PUMP = SparkFun-Electromechanical:MOTOR: Vibration Motor- ROB-08449 Physical dimension and wire connections for this powerful vibration motor. Motor has a self adhesive backing.
G1 = battery:AB9V: 9-V BATTERY CLIP
GLVS = SparkFun-Electromechanical:SWITCH-SPST-2
J1 = FSAE Eletric:M23
J2 = FSAE Eletric:M35
JP1 = SparkFun-Connectors:M30: 1x30 .1" header
JP2 = SparkFun-Connectors:M05: Header 5 Standard 5-pin 0.1" header. Use with straight break away headers (SKU : PRT-00116), right angle break away headers (PRT-00553), swiss pins (PRT-00743), machine pins (PRT-00117), and female headers (PRT-00115). Molex polarized connector foot print use with SKU : PRT-08230 with associated crimp pins and housings.
JP6 JP8 JP15 JP16 = SparkFun-Connectors:M20: 1x20 .1" header This is just like the LOCK variant in that the holes are staggared by 5 mil, but except for the last two holes. They are not altered from the "standard" footprint layout. This is used for a special purpose on the layout of our Graphic LCD Backpack. Make sure you want to use this device before selecting it for you project!
JP7 JP9-JP12 = SparkFun-Connectors:M02: Standard 2-pin 0.1" header. Use with - straight break away headers ( PRT-00116) - right angle break away headers (PRT-00553) - swiss pins (PRT-00743) - machine pins (PRT-00117) - female headers (PRT-00115) Molex polarized connector foot print use with: PRT-08233 with associated crimp pins and housings. 2.54_SCREWTERM for use with PRT-10571. 3.5mm Screw Terminal footprints for PRT-08084 5mm Screw Terminal footprints for use with PRT-08432; PROD_ID: CONN-09863; SKU: PRT-09914
K1-K4 = relay:APF30212A: Compliant with European standards 1a/1c 6A Slim power relays Source: Data sheet <http://pewa.panasonic.com/assets/pcsd/catalog/pf-catalog.pdf>; OC_FARNELL: unknown
M1 = FSAE Eletric:MOTOR-3PHASE
MAIN-CON MAIN-CON1 = SparkFun-Connectors:M12: Header 12 Standard 12-pin 0.1" header. Use with straight break away headers (SKU : PRT-00116), right angle break away headers (PRT-00553), swiss pins (PRT-00743), machine pins (PRT-00117), and female headers (PRT-00115).
MC-1 = FSAE Eletric:PM100DX
R1-R9 = SparkFun-Passives:RESISTOR: Resistor Basic schematic elements and footprints for 0603, 1206, and PTH resistors.
S1 = SparkFun-Electromechanical:SWITCH-SPDT: SPDT Switch Simple slide switch, Spark Fun Electronics SKU : COM-00102 DPDT SMT slide switch, AYZ0202, SWCH-08179
S2-S6 = switch-misc:PVA1: ITT SWITCH
S7-S13 = SparkFun-Electromechanical:SWITCH-MOMENTARY-2: Various NO switches- pushbuttons, reed, etc
S14-S17 = switch-reed:REED-SWITCH-: Reed Sensor; MF: COTO TECHNOLOGY; MPN: CT10-1530-G1; OC_FARNELL: 1081696
S18 = SparkFun-Electromechanical:SWITCH-DPDT: DPDT Version of the COM-00597; PROD_ID: SWCH-08179
SP1-SP4 = opto-honeywell:HFD3000: OPTO SENSOR DEVICE; OC_FARNELL: unknown; OC_NEWARK: unknown
SP5 = buzzer:AL23P: SPEAKER Source: Buerklin; OC_FARNELL: unknown; OC_NEWARK: unknown
U$1 = FSAE Eletric:IMD